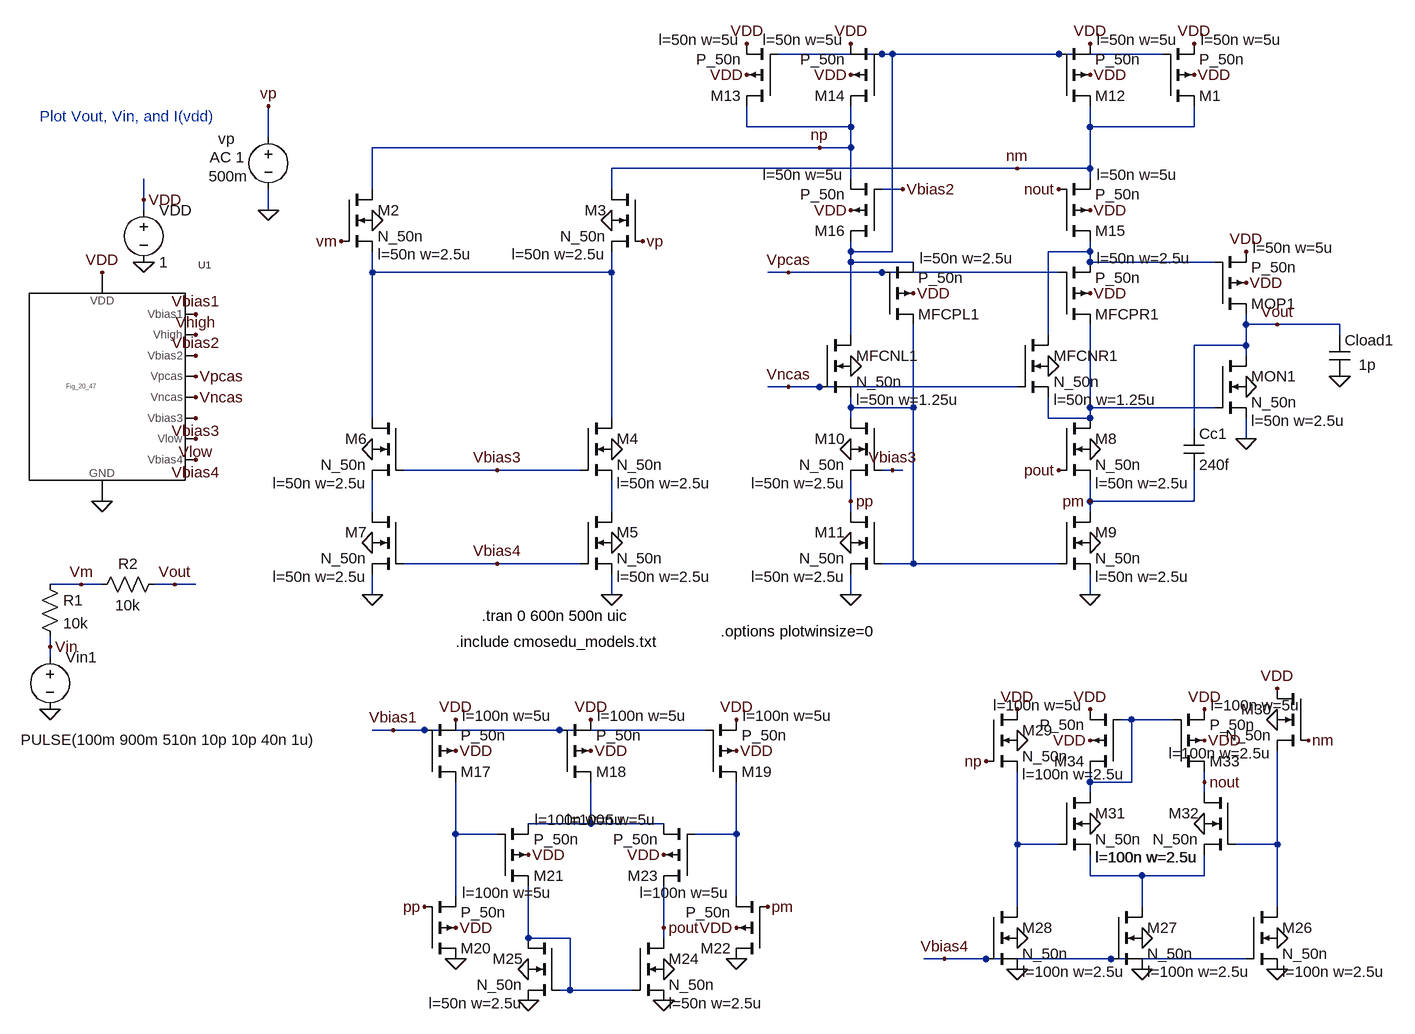
[diagram p0: schematic Fig24_52_tran.asc]
Fig24_52_tran.asc, the LTspice schematic file:
Version 4
SHEET 1 3376 680
WIRE 2496 -1200 2336 -1200
WIRE 2512 -1200 2496 -1200
WIRE 2768 -1200 2512 -1200
WIRE 2928 -1200 2768 -1200
WIRE 2288 -1088 2288 -1120
WIRE 2448 -1088 2448 -1120
WIRE 2448 -1088 2288 -1088
WIRE 2816 -1088 2816 -1120
WIRE 2976 -1088 2976 -1120
WIRE 2976 -1088 2816 -1088
WIRE 1552 -1072 1552 -1120
WIRE 2400 -1056 1712 -1056
WIRE 2448 -1056 2448 -1088
WIRE 2448 -1056 2400 -1056
WIRE 2704 -1024 2080 -1024
WIRE 2816 -1024 2816 -1088
WIRE 2816 -1024 2704 -1024
WIRE 2448 -1008 2448 -1056
WIRE 2816 -1008 2816 -1024
WIRE 1712 -992 1712 -1056
WIRE 2080 -992 2080 -1024
WIRE 2528 -992 2496 -992
WIRE 1360 -976 1360 -1008
WIRE 1360 -960 1360 -976
WIRE 1552 -960 1552 -992
WIRE 2448 -896 2448 -912
WIRE 2512 -896 2512 -1200
WIRE 2512 -896 2448 -896
WIRE 2816 -896 2816 -912
WIRE 2816 -896 2752 -896
WIRE 2448 -880 2448 -896
WIRE 2544 -880 2448 -880
WIRE 2816 -880 2816 -896
WIRE 3008 -880 2816 -880
WIRE 1712 -864 1712 -896
WIRE 2080 -864 2080 -896
WIRE 2080 -864 1712 -864
WIRE 2352 -864 2320 -864
WIRE 2496 -864 2352 -864
WIRE 2768 -864 2496 -864
WIRE 3056 -784 3056 -800
WIRE 3104 -784 3056 -784
WIRE 3200 -784 3104 -784
WIRE 2448 -768 2448 -880
WIRE 2752 -768 2752 -896
WIRE 3200 -768 3200 -784
WIRE 3056 -752 3056 -784
WIRE 3056 -752 2976 -752
WIRE 3056 -736 3056 -752
WIRE 2352 -688 2320 -688
WIRE 2400 -688 2352 -688
WIRE 2704 -688 2400 -688
WIRE 2448 -656 2448 -672
WIRE 2544 -656 2544 -784
WIRE 2544 -656 2448 -656
WIRE 2816 -656 2816 -784
WIRE 3008 -656 2816 -656
WIRE 1712 -640 1712 -864
WIRE 2080 -640 2080 -864
WIRE 2448 -640 2448 -656
WIRE 2752 -640 2752 -672
WIRE 2816 -640 2816 -656
WIRE 2816 -640 2752 -640
WIRE 2976 -624 2976 -752
WIRE 3056 -608 3056 -640
WIRE 1904 -560 1760 -560
WIRE 2032 -560 1904 -560
WIRE 2512 -560 2496 -560
WIRE 2528 -560 2512 -560
WIRE 2448 -512 2448 -544
WIRE 2816 -512 2816 -544
WIRE 2976 -512 2976 -560
WIRE 2976 -512 2816 -512
WIRE 1712 -496 1712 -544
WIRE 2080 -496 2080 -544
WIRE 2448 -496 2448 -512
WIRE 2816 -496 2816 -512
WIRE 1904 -416 1760 -416
WIRE 2032 -416 1904 -416
WIRE 2544 -416 2544 -656
WIRE 2544 -416 2496 -416
WIRE 2768 -416 2544 -416
WIRE 1264 -384 1216 -384
WIRE 1296 -384 1264 -384
WIRE 1408 -384 1376 -384
WIRE 1440 -384 1408 -384
WIRE 1712 -368 1712 -400
WIRE 2080 -368 2080 -400
WIRE 2448 -368 2448 -400
WIRE 2816 -368 2816 -400
WIRE 1216 -288 1216 -304
WIRE 1216 -272 1216 -288
WIRE 2880 -176 2864 -176
WIRE 2944 -176 2880 -176
WIRE 1744 -160 1712 -160
WIRE 1792 -160 1744 -160
WIRE 2000 -160 1792 -160
WIRE 2224 -160 2000 -160
WIRE 2816 -80 2816 -96
WIRE 2880 -80 2880 -176
WIRE 2880 -80 2816 -80
WIRE 2992 -80 2992 -96
WIRE 2816 -64 2816 -80
WIRE 2992 -64 2992 -80
WIRE 2048 -16 2048 -80
WIRE 2048 -16 1952 -16
WIRE 2160 -16 2048 -16
WIRE 1840 0 1840 -80
WIRE 1904 0 1840 0
WIRE 2272 0 2272 -80
WIRE 2272 0 2208 0
WIRE 2704 16 2704 -96
WIRE 2768 16 2704 16
WIRE 3104 16 3104 -128
WIRE 3104 16 3040 16
WIRE 2816 64 2816 32
WIRE 2896 64 2816 64
WIRE 2992 64 2992 32
WIRE 2992 64 2896 64
WIRE 1840 96 1840 0
WIRE 2272 96 2272 0
WIRE 2704 112 2704 16
WIRE 2896 112 2896 64
WIRE 3104 112 3104 16
WIRE 2160 144 2160 80
WIRE 1952 160 1952 80
WIRE 2016 160 1952 160
WIRE 2160 160 2160 144
WIRE 2592 192 2560 192
WIRE 2656 192 2592 192
WIRE 2848 192 2656 192
WIRE 3056 192 2848 192
WIRE 2016 240 2016 160
WIRE 2016 240 2000 240
WIRE 2112 240 2016 240
FLAG 1360 -880 0
FLAG 1360 -976 VDD
FLAG 1296 -864 VDD
FLAG 1296 -512 0
FLAG 1440 -800 Vbias1
FLAG 1440 -768 Vhigh
FLAG 1440 -736 Vbias2
FLAG 1440 -640 Vbias3
FLAG 1440 -704 Vpcas
FLAG 1440 -672 Vncas
FLAG 1440 -576 Vbias4
FLAG 1440 -608 Vlow
FLAG 1552 -960 0
FLAG 1552 -1120 vp
FLAG 1216 -192 0
FLAG 1408 -384 Vout
FLAG 1264 -384 Vm
FLAG 1216 -288 Vin
FLAG 2976 -1168 VDD
FLAG 1712 -944 0
FLAG 2080 -944 0
FLAG 1664 -912 vm
FLAG 2128 -912 vp
FLAG 2080 -592 0
FLAG 2080 -448 0
FLAG 2080 -368 0
FLAG 1712 -592 0
FLAG 1712 -448 0
FLAG 1712 -368 0
FLAG 1904 -560 Vbias3
FLAG 1904 -416 Vbias4
FLAG 2816 -592 0
FLAG 2816 -448 0
FLAG 2816 -368 0
FLAG 2448 -592 0
FLAG 2448 -448 0
FLAG 2448 -368 0
FLAG 2512 -560 Vbias3
FLAG 2816 -1168 VDD
FLAG 2816 -1216 VDD
FLAG 2976 -1216 VDD
FLAG 2288 -1168 VDD
FLAG 2448 -1168 VDD
FLAG 2448 -1216 VDD
FLAG 2288 -1216 VDD
FLAG 2816 -960 VDD
FLAG 2448 -960 VDD
FLAG 2528 -992 Vbias2
FLAG 3200 -704 0
FLAG 3104 -784 Vout
FLAG 2544 -832 VDD
FLAG 2816 -832 VDD
FLAG 2752 -720 0
FLAG 2448 -720 0
FLAG 2352 -864 Vpcas
FLAG 2352 -688 Vncas
FLAG 3056 -848 VDD
FLAG 3056 -896 VDD
FLAG 3056 -688 0
FLAG 3056 -608 0
FLAG 2768 -992 nout
FLAG 2704 -1024 nm
FLAG 2400 -1056 np
FLAG 2768 -560 pout
FLAG 2816 -512 pm
FLAG 2448 -512 pp
FLAG 1840 -128 VDD
FLAG 1840 -176 VDD
FLAG 2048 -128 VDD
FLAG 2048 -176 VDD
FLAG 2272 -128 VDD
FLAG 2272 -176 VDD
FLAG 1744 -160 Vbias1
FLAG 1840 144 VDD
FLAG 1952 32 VDD
FLAG 2272 144 VDD
FLAG 2160 32 VDD
FLAG 2160 208 0
FLAG 1952 208 0
FLAG 1952 256 0
FLAG 2160 256 0
FLAG 2272 192 0
FLAG 1840 192 0
FLAG 1792 112 pp
FLAG 2320 112 pm
FLAG 2160 144 pout
FLAG 3104 160 0
FLAG 3104 208 0
FLAG 2896 160 0
FLAG 2896 208 0
FLAG 2704 160 0
FLAG 2704 208 0
FLAG 2592 192 Vbias4
FLAG 2704 -144 0
FLAG 3104 -176 0
FLAG 2704 -192 VDD
FLAG 3104 -224 VDD
FLAG 2656 -112 np
FLAG 3152 -144 nm
FLAG 2816 -16 0
FLAG 2992 -16 0
FLAG 2992 -144 VDD
FLAG 2992 -192 VDD
FLAG 2816 -144 VDD
FLAG 2816 -192 VDD
FLAG 2992 -80 nout
SYMBOL voltage 1360 -976 R0
WINDOW 123 0 0 Left 2
WINDOW 39 0 0 Left 2
SYMATTR InstName VDD
SYMATTR Value 1
SYMBOL Fig_20_47 1296 -688 R0
SYMATTR InstName U1
SYMBOL voltage 1552 -1088 R0
WINDOW 0 -77 18 Left 2
WINDOW 3 -92 76 Left 2
WINDOW 123 -90 47 Left 2
WINDOW 39 0 0 Left 2
SYMATTR InstName vp
SYMATTR Value 500m
SYMATTR Value2 AC 1
SYMBOL voltage 1216 -288 R0
WINDOW 3 -45 143 Left 2
WINDOW 123 0 0 Left 2
WINDOW 39 0 0 Left 2
SYMATTR Value PULSE(100m 900m 510n 10p 10p 40n 1u)
SYMATTR InstName Vin1
SYMBOL res 1200 -400 R0
SYMATTR InstName R1
SYMATTR Value 10k
SYMBOL res 1280 -368 R270
WINDOW 0 32 56 VTop 2
WINDOW 3 0 56 VBottom 2
SYMATTR InstName R2
SYMATTR Value 10k
SYMBOL pmos4 2928 -1120 M180
WINDOW 123 58 102 Left 2
WINDOW 0 56 16 Left 2
SYMATTR Value2 l=50n w=5u
SYMATTR InstName M1
SYMATTR Value P_50n
SYMBOL nmos4 1664 -992 R0
WINDOW 123 56 100 Left 2
SYMATTR Value2 l=50n w=2.5u
SYMATTR InstName M2
SYMATTR Value N_50n
SYMBOL nmos4 2128 -992 M0
WINDOW 123 56 100 Left 2
SYMATTR Value2 l=50n w=2.5u
SYMATTR InstName M3
SYMATTR Value N_50n
SYMBOL nmos4 2032 -640 R0
WINDOW 123 56 100 Left 2
SYMATTR Value2 l=50n w=2.5u
SYMATTR InstName M4
SYMATTR Value N_50n
SYMBOL nmos4 2032 -496 R0
WINDOW 123 56 100 Left 2
SYMATTR Value2 l=50n w=2.5u
SYMATTR InstName M5
SYMATTR Value N_50n
SYMBOL nmos4 1760 -640 M0
WINDOW 123 56 100 Left 2
SYMATTR Value2 l=50n w=2.5u
SYMATTR InstName M6
SYMATTR Value N_50n
SYMBOL nmos4 1760 -496 M0
WINDOW 123 56 100 Left 2
SYMATTR Value2 l=50n w=2.5u
SYMATTR InstName M7
SYMATTR Value N_50n
SYMBOL nmos4 2768 -640 R0
WINDOW 123 56 100 Left 2
SYMATTR Value2 l=50n w=2.5u
SYMATTR InstName M8
SYMATTR Value N_50n
SYMBOL nmos4 2768 -496 R0
WINDOW 123 56 100 Left 2
SYMATTR Value2 l=50n w=2.5u
SYMATTR InstName M9
SYMATTR Value N_50n
SYMBOL nmos4 2496 -640 M0
WINDOW 123 56 100 Left 2
SYMATTR Value2 l=50n w=2.5u
SYMATTR InstName M10
SYMATTR Value N_50n
SYMBOL nmos4 2496 -496 M0
WINDOW 123 56 100 Left 2
SYMATTR Value2 l=50n w=2.5u
SYMATTR InstName M11
SYMATTR Value N_50n
SYMBOL pmos4 2768 -1120 M180
WINDOW 123 58 102 Left 2
WINDOW 0 56 16 Left 2
SYMATTR Value2 l=50n w=5u
SYMATTR InstName M12
SYMATTR Value P_50n
SYMBOL pmos4 2336 -1120 R180
WINDOW 123 58 102 Left 2
WINDOW 0 56 16 Left 2
SYMATTR Value2 l=50n w=5u
SYMATTR InstName M13
SYMATTR Value P_50n
SYMBOL pmos4 2496 -1120 R180
WINDOW 123 58 102 Left 2
WINDOW 0 56 16 Left 2
SYMATTR Value2 l=50n w=5u
SYMATTR InstName M14
SYMATTR Value P_50n
SYMBOL pmos4 2768 -912 M180
WINDOW 123 58 102 Left 2
WINDOW 0 56 16 Left 2
SYMATTR Value2 l=50n w=5u
SYMATTR InstName M15
SYMATTR Value P_50n
SYMBOL pmos4 2496 -912 R180
WINDOW 123 58 102 Left 2
WINDOW 0 56 16 Left 2
SYMATTR Value2 l=50n w=5u
SYMATTR InstName M16
SYMATTR Value P_50n
SYMBOL cap 3184 -768 R0
WINDOW 3 45 46 Left 2
SYMATTR Value 1p
SYMATTR InstName Cload1
SYMBOL pmos4 2496 -784 M180
WINDOW 123 58 102 Left 2
WINDOW 0 56 16 Left 2
SYMATTR Value2 l=50n w=2.5u
SYMATTR InstName MFCPL1
SYMATTR Value P_50n
SYMBOL pmos4 2768 -784 M180
WINDOW 123 58 102 Left 2
WINDOW 0 56 16 Left 2
SYMATTR Value2 l=50n w=2.5u
SYMATTR InstName MFCPR1
SYMATTR Value P_50n
SYMBOL nmos4 2704 -768 R0
WINDOW 123 56 100 Left 2
SYMATTR Value2 l=50n w=1.25u
SYMATTR InstName MFCNR1
SYMATTR Value N_50n
SYMBOL nmos4 2400 -768 R0
WINDOW 123 56 100 Left 2
SYMATTR Value2 l=50n w=1.25u
SYMATTR InstName MFCNL1
SYMATTR Value N_50n
SYMBOL pmos4 3008 -800 M180
WINDOW 123 58 102 Left 2
WINDOW 0 56 16 Left 2
SYMATTR Value2 l=50n w=5u
SYMATTR InstName MOP1
SYMATTR Value P_50n
SYMBOL nmos4 3008 -736 R0
WINDOW 123 56 100 Left 2
SYMATTR Value2 l=50n w=2.5u
SYMATTR InstName MON1
SYMATTR Value N_50n
SYMBOL cap 2960 -624 R0
SYMATTR InstName Cc1
SYMATTR Value 240f
SYMBOL pmos4 1792 -80 M180
WINDOW 123 58 102 Left 2
WINDOW 0 56 16 Left 2
SYMATTR Value2 l=100n w=5u
SYMATTR InstName M17
SYMATTR Value P_50n
SYMBOL pmos4 2000 -80 M180
WINDOW 123 58 102 Left 2
WINDOW 0 56 16 Left 2
SYMATTR Value2 l=100n w=5u
SYMATTR InstName M18
SYMATTR Value P_50n
SYMBOL pmos4 2224 -80 M180
WINDOW 123 58 102 Left 2
WINDOW 0 56 16 Left 2
SYMATTR Value2 l=100n w=5u
SYMATTR InstName M19
SYMATTR Value P_50n
SYMBOL pmos4 1792 192 M180
WINDOW 123 58 102 Left 2
WINDOW 0 56 16 Left 2
SYMATTR Value2 l=100n w=5u
SYMATTR InstName M20
SYMATTR Value P_50n
SYMBOL pmos4 1904 80 M180
WINDOW 123 58 102 Left 2
WINDOW 0 56 16 Left 2
SYMATTR Value2 l=100n w=5u
SYMATTR InstName M21
SYMATTR Value P_50n
SYMBOL pmos4 2320 192 R180
WINDOW 123 58 102 Left 2
WINDOW 0 56 16 Left 2
SYMATTR Value2 l=100n w=5u
SYMATTR InstName M22
SYMATTR Value P_50n
SYMBOL pmos4 2208 80 R180
WINDOW 123 58 102 Left 2
WINDOW 0 56 16 Left 2
SYMATTR Value2 l=100n w=5u
SYMATTR InstName M23
SYMATTR Value P_50n
SYMBOL nmos4 2112 160 R0
WINDOW 123 56 100 Left 2
SYMATTR Value2 l=50n w=2.5u
SYMATTR InstName M24
SYMATTR Value N_50n
SYMBOL nmos4 2000 160 M0
WINDOW 123 56 100 Left 2
SYMATTR Value2 l=50n w=2.5u
SYMATTR InstName M25
SYMATTR Value N_50n
SYMBOL nmos4 3056 112 R0
WINDOW 123 56 100 Left 2
SYMATTR Value2 l=100n w=2.5u
SYMATTR InstName M26
SYMATTR Value N_50n
SYMBOL nmos4 2848 112 R0
WINDOW 123 56 100 Left 2
SYMATTR Value2 l=100n w=2.5u
SYMATTR InstName M27
SYMATTR Value N_50n
SYMBOL nmos4 2656 112 R0
WINDOW 123 56 100 Left 2
SYMATTR Value2 l=100n w=2.5u
SYMATTR InstName M28
SYMATTR Value N_50n
SYMBOL nmos4 2656 -192 R0
WINDOW 123 56 100 Left 2
SYMATTR Value2 l=100n w=2.5u
SYMATTR InstName M29
SYMATTR Value N_50n
SYMBOL nmos4 3152 -224 M0
WINDOW 123 56 100 Left 2
SYMATTR Value2 l=100n w=2.5u
SYMATTR InstName M30
SYMATTR Value N_50n
SYMBOL nmos4 2768 -64 R0
WINDOW 123 56 100 Left 2
SYMATTR Value2 l=100n w=2.5u
SYMATTR InstName M31
SYMATTR Value N_50n
SYMBOL nmos4 3040 -64 M0
WINDOW 123 56 100 Left 2
SYMATTR Value2 l=100n w=2.5u
SYMATTR InstName M32
SYMATTR Value N_50n
SYMBOL pmos4 2944 -96 M180
WINDOW 123 58 102 Left 2
WINDOW 0 56 16 Left 2
SYMATTR Value2 l=100n w=5u
SYMATTR InstName M33
SYMATTR Value P_50n
SYMBOL pmos4 2864 -96 R180
WINDOW 123 58 102 Left 2
WINDOW 0 56 16 Left 2
SYMATTR Value2 l=100n w=5u
SYMATTR InstName M34
SYMATTR Value P_50n
TEXT 1840 -296 Left 2 !.include cmosedu_models.txt
TEXT 1880 -336 Left 2 !.tran 0 600n 500n uic
TEXT 1200 -1104 Left 2 ;Plot Vout, Vin, and I(vdd)
TEXT 2248 -312 Left 2 !.options plotwinsize=0

The netlist it stands for:
* Fig24_52_tran.asc
VDD VDD 0 1
XU1 Vbias1 Vhigh Vbias2 Vpcas Vncas Vbias3 Vlow Vbias4 VDD 0 Fig_20_47  ; pins Vbias1 Vhigh Vbias2 Vpcas Vncas Vbias3 Vlow Vbias4 VDD GND
vp vp 0 500m AC 1
Vin1 Vin 0 PULSE(100m 900m 510n 10p 10p 40n 1u)
R1 Vm Vin 10k
R2 Vm Vout 10k
M1 nm N001 VDD VDD P_50n l=50n w=5u
M2 np Vm N003 0 N_50n l=50n w=2.5u
M3 nm vp N003 0 N_50n l=50n w=2.5u
M4 N003 Vbias3 N007 0 N_50n l=50n w=2.5u
M5 N007 Vbias4 0 0 N_50n l=50n w=2.5u
M6 N003 Vbias3 N006 0 N_50n l=50n w=2.5u
M7 N006 Vbias4 0 0 N_50n l=50n w=2.5u
M8 N005 pout pm 0 N_50n l=50n w=2.5u
M9 pm N004 0 0 N_50n l=50n w=2.5u
M10 N004 Vbias3 pp 0 N_50n l=50n w=2.5u
M11 pp N004 0 0 N_50n l=50n w=2.5u
M12 nm N001 VDD VDD P_50n l=50n w=5u
M13 np N001 VDD VDD P_50n l=50n w=5u
M14 np N001 VDD VDD P_50n l=50n w=5u
M15 N002 nout nm VDD P_50n l=50n w=5u
M16 N001 Vbias2 np VDD P_50n l=50n w=5u
Cload1 Vout 0 1p
MFCPL1 N004 Vpcas N001 VDD P_50n l=50n w=2.5u
MFCPR1 N005 Vpcas N002 VDD P_50n l=50n w=2.5u
MFCNR1 N002 Vncas N005 0 N_50n l=50n w=1.25u
MFCNL1 N001 Vncas N004 0 N_50n l=50n w=1.25u
MOP1 Vout N002 VDD VDD P_50n l=50n w=5u
MON1 Vout N005 0 0 N_50n l=50n w=2.5u
Cc1 Vout pm 240f
M17 N010 Vbias1 VDD VDD P_50n l=100n w=5u
M18 N009 Vbias1 VDD VDD P_50n l=100n w=5u
M19 N011 Vbias1 VDD VDD P_50n l=100n w=5u
M20 0 pp N010 VDD P_50n l=100n w=5u
M21 N015 N010 N009 VDD P_50n l=100n w=5u
M22 0 pm N011 VDD P_50n l=100n w=5u
M23 pout N011 N009 VDD P_50n l=100n w=5u
M24 pout N015 0 0 N_50n l=50n w=2.5u
M25 N015 N015 0 0 N_50n l=50n w=2.5u
M26 N013 Vbias4 0 0 N_50n l=100n w=2.5u
M27 N014 Vbias4 0 0 N_50n l=100n w=2.5u
M28 N012 Vbias4 0 0 N_50n l=100n w=2.5u
M29 VDD np N012 0 N_50n l=100n w=2.5u
M30 VDD nm N013 0 N_50n l=100n w=2.5u
M31 N008 N012 N014 0 N_50n l=100n w=2.5u
M32 nout N013 N014 0 N_50n l=100n w=2.5u
M33 nout N008 VDD VDD P_50n l=100n w=5u
M34 N008 N008 VDD VDD P_50n l=100n w=5u
.model NMOS NMOS
.model PMOS PMOS
.lib standard.mos
.include cmosedu_models.txt
.tran 0 600n 500n uic
* Plot Vout, Vin, and I(vdd)
.options plotwinsize=0
.backanno
.end